# EasyEDA Pro project the ties .epro, board PCB1
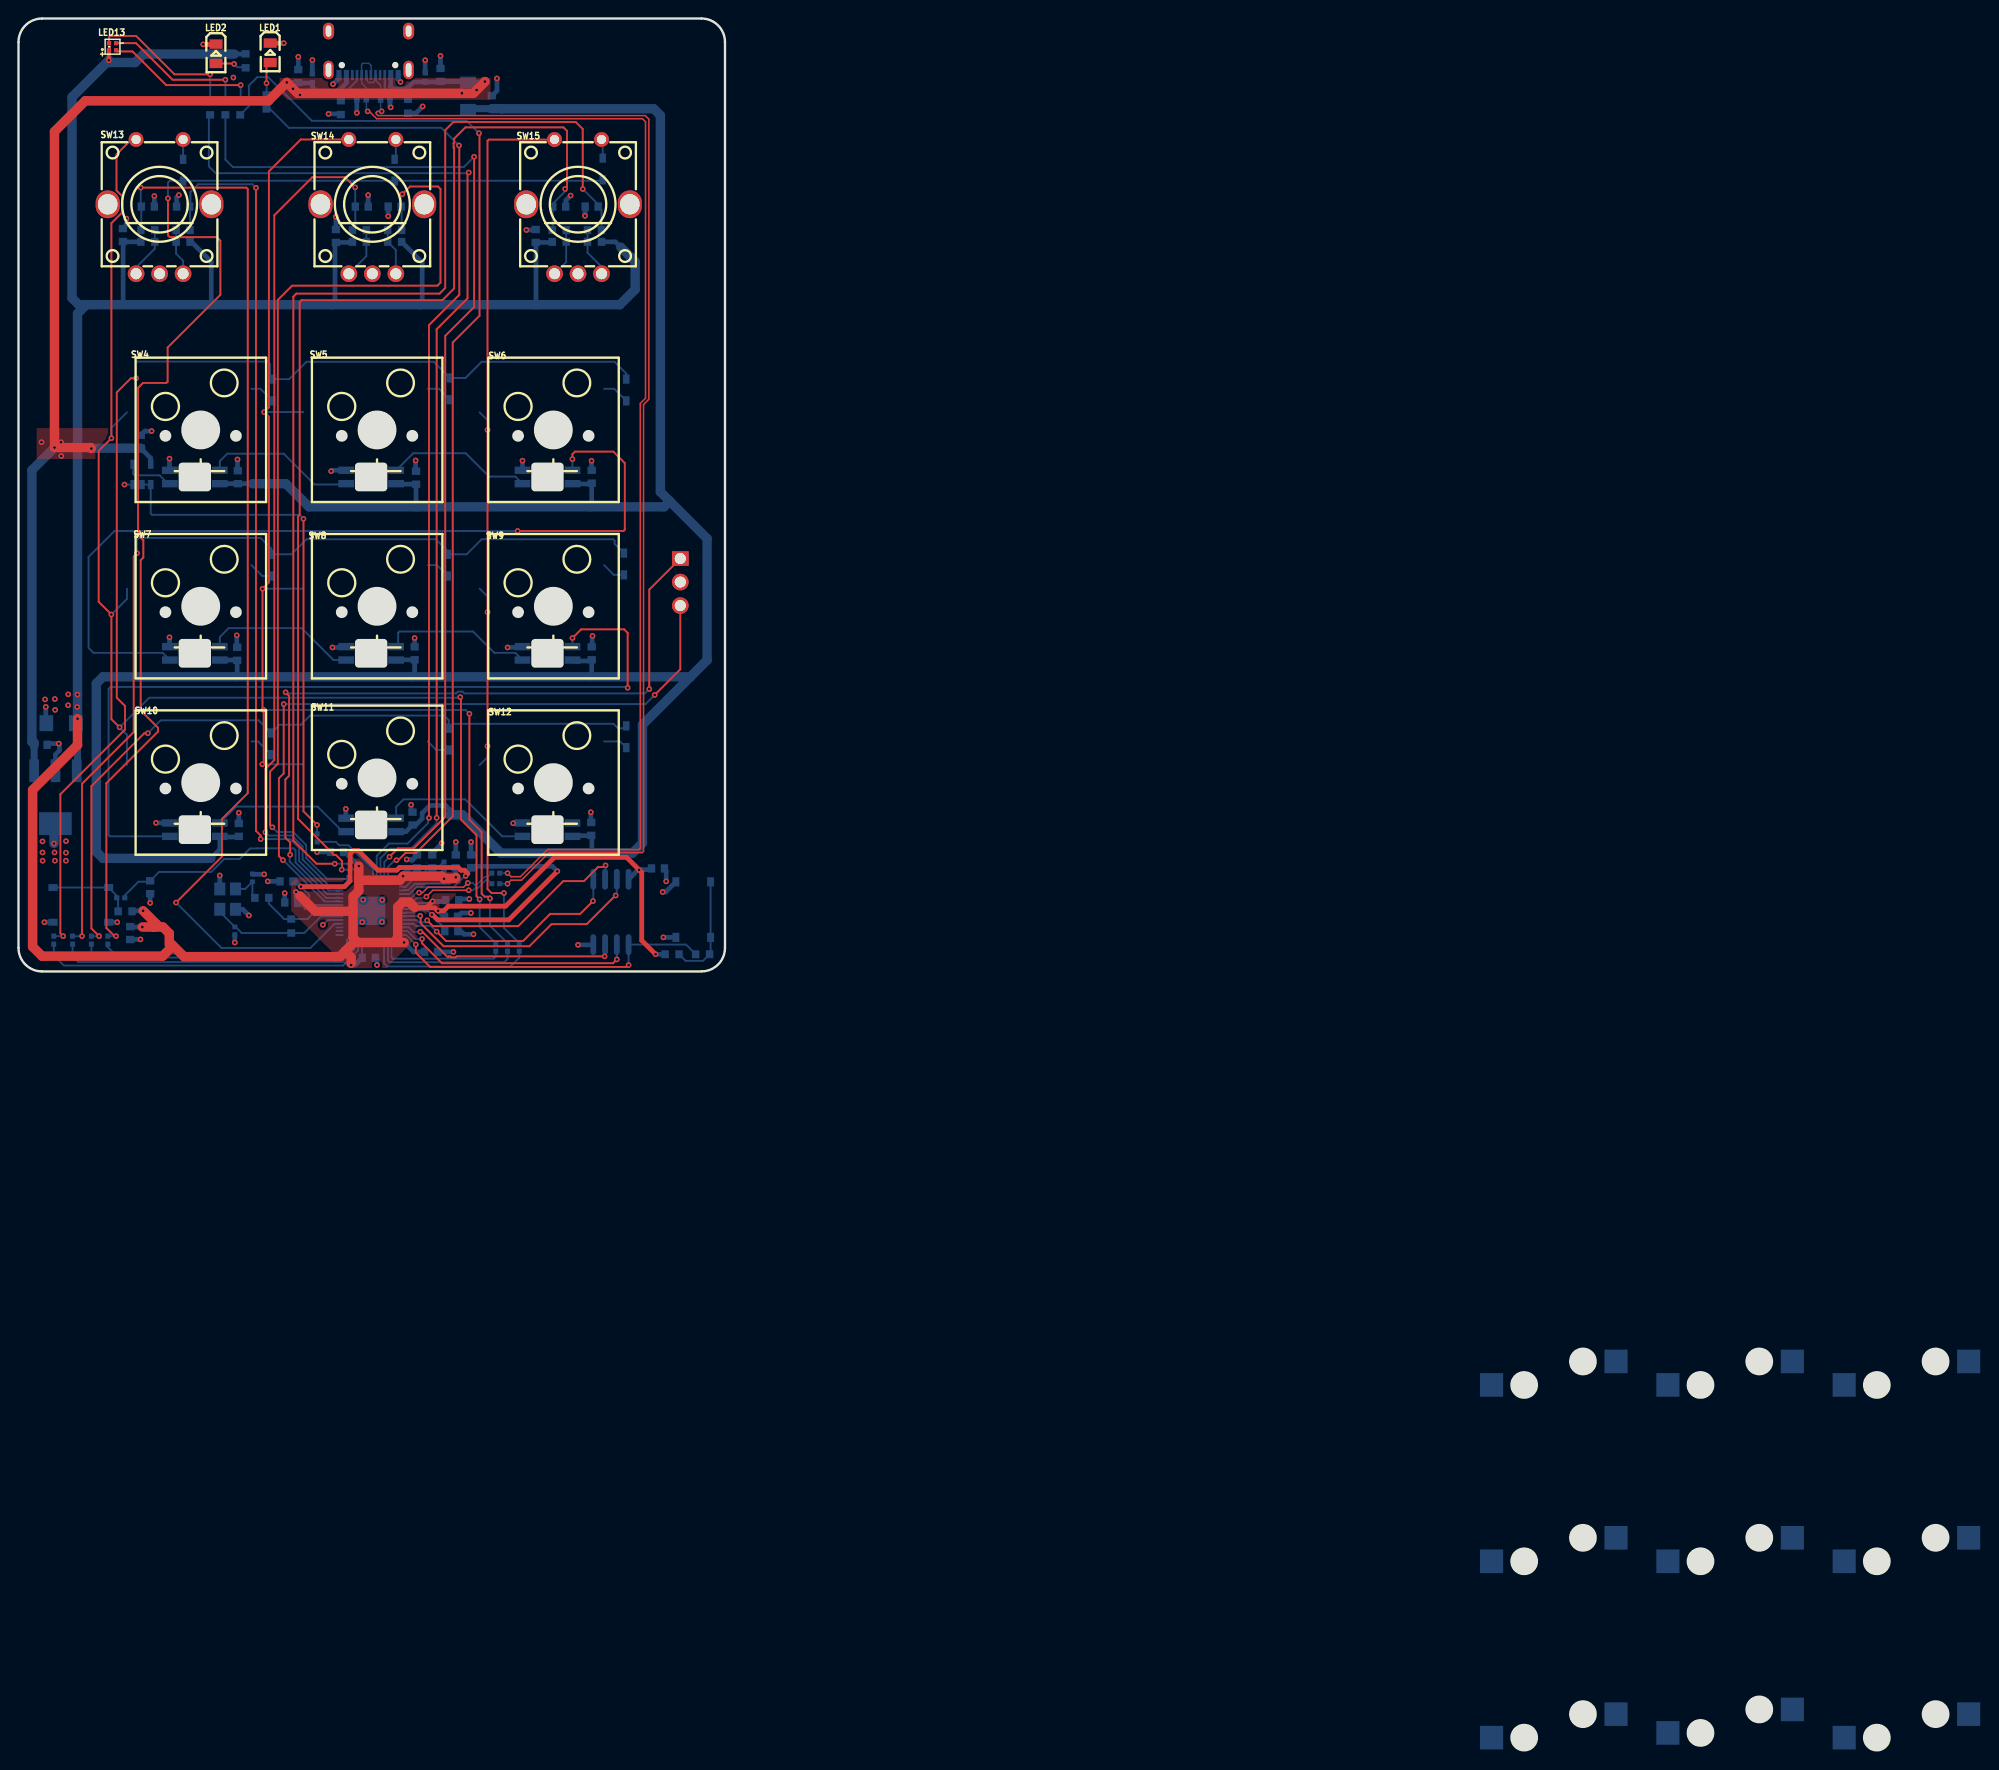
[diagram p2: board, top side]
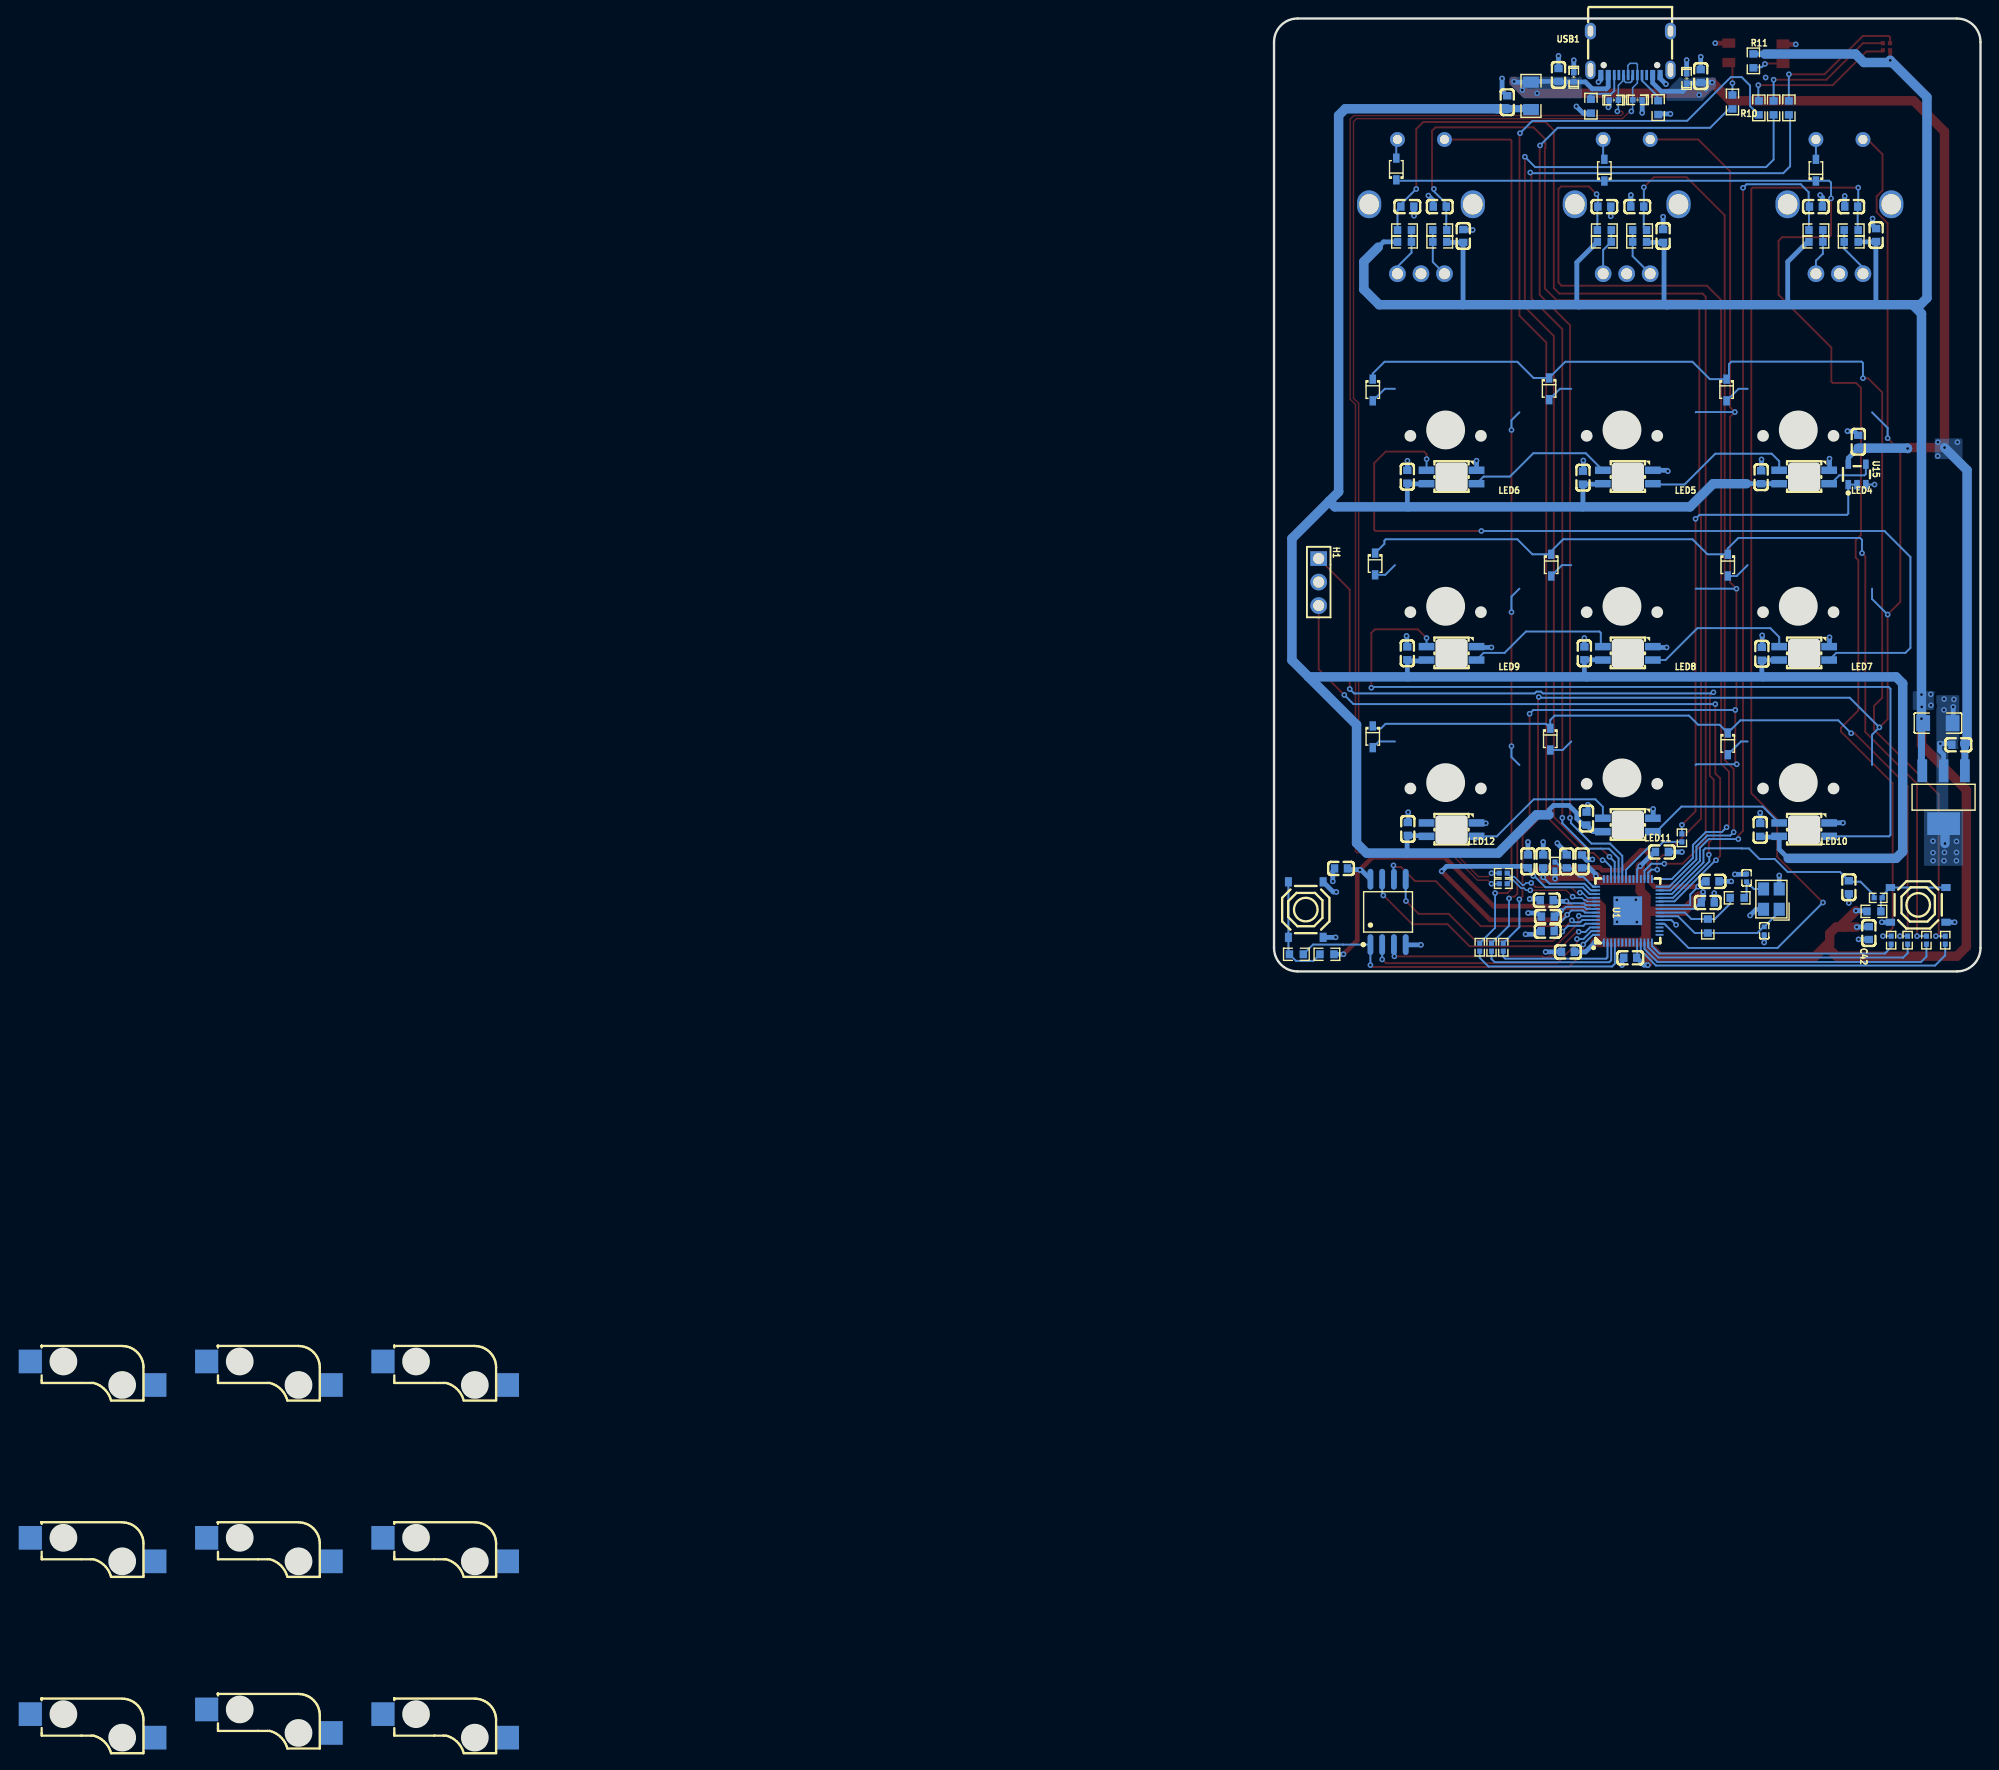
[diagram p3: board, bottom side, seen from below]

Outline 208.62 x 187.22 mm; copper layers: Top Layer, Inner1, Inner2, Bottom Layer. Coordinates in mm from the lower left corner of the outline.
Outline path: 0,184.68 0,86.81 arc(0.74,85.02) 2.54,84.27 73.79,84.27 arc(75.58,85.02) 76.33,86.81 76.33,184.68 arc(75.58,186.48) 73.79,187.22 2.54,187.22 arc(0.74,186.48) 0,184.68
Stack: Top Layer 0.035mm Outer layer thickness 1oz / Dielectric1 0.2104mm 7628 RC49% 8.6mil / Inner1 0.0152mm Inner layer thickness / Dielectric2 1.065mm 1.1mm H/HOZ Copper / Inner2 0.0152mm Inner layer thickness / Dielectric3 0.2104mm 7628 RC49% 8.6mil / Bottom Layer 0.035mm Outer layer thickness 1oz

## Design rules (mm)
net USBN: USB
net USBP: USB
net CON_USB_P: USB_CON
net CON_USB_N: USB_CON
spacing copperThickness1oz (default): track to track 0.178, other pairs 0.076 to 0.305
spacing copperThickness2oz: track to track 0.203, other pairs 0.152 to 0.3
spacing copperThicknessInner0.5oz: track to track 0.089, other pairs 0.152 to 0.3
spacing Plane_innerPlane: track to track 0.178, other pairs 0.076 to 0.305
spacing Copper_copperRegion: track to track 0.178, other pairs 0.076 to 0.305
track width copperThickness1oz (default): min 0.102, default 0.203, max 2.54
track width copperThickness2oz: min 0.203, default 0.254, max 2.54
track width copperThickness0.5oz: min 0.089, default 0.254, max 2.54
differential pair differentialPair (default): width min 0.155, default 0.155, max 0.203; gap min 0.178, default 0.191
region e1 uses Copper_copperRegion
region e2 uses Copper_copperRegion
region e3 uses Copper_copperRegion
region e4 uses Copper_copperRegion
region e5 uses Copper_copperRegion
region e6 uses Copper_copperRegion
region e7 uses Copper_copperRegion
region e8 uses Copper_copperRegion
region e9 uses Copper_copperRegion
region e10 uses Copper_copperRegion
region e11 uses Copper_copperRegion
region e12 uses Copper_copperRegion
region e13 uses Copper_copperRegion
region e14 uses Copper_copperRegion
region e15 uses Copper_copperRegion
region e16 uses Copper_copperRegion
region e17 uses Copper_copperRegion
region e18 uses Copper_copperRegion
region e19 uses Copper_copperRegion
region e20 uses Copper_copperRegion
region e21 uses Copper_copperRegion
region e22 uses Copper_copperRegion
region e23 uses Copper_copperRegion
region e24 uses Copper_copperRegion
region e25 uses Copper_copperRegion
region e26 uses Copper_copperRegion
region e27 uses Copper_copperRegion
region e28 uses Copper_copperRegion
region e29 uses Copper_copperRegion
region e30 uses Copper_copperRegion
region e31 uses Copper_copperRegion
region e32 uses Copper_copperRegion
region e33 uses Copper_copperRegion
region e34 uses Copper_copperRegion
region e35 uses Copper_copperRegion
region e36 uses Copper_copperRegion
region e37 uses Copper_copperRegion
region e38 uses Copper_copperRegion
region e39 uses Copper_copperRegion
region e40 uses Copper_copperRegion
region e41 uses Copper_copperRegion
region e42 uses Copper_copperRegion
region e43 uses Copper_copperRegion
region e44 uses Copper_copperRegion
region e45 uses Copper_copperRegion
region e46 uses Copper_copperRegion
region e47 uses Copper_copperRegion
region e48 uses Copper_copperRegion
region e49 uses Copper_copperRegion
region e50 uses Copper_copperRegion
region e51 uses Copper_copperRegion
region e52 uses Copper_copperRegion
region e53 uses Copper_copperRegion
region e54 uses Copper_copperRegion
region e55 uses Copper_copperRegion
region e56 uses Copper_copperRegion
region e57 uses Copper_copperRegion
region e58 uses Copper_copperRegion
region e59 uses Copper_copperRegion
region e60 uses Copper_copperRegion
region e61 uses Copper_copperRegion
region e62 uses Copper_copperRegion
region e63 uses Copper_copperRegion
region e64 uses Copper_copperRegion
region e65 uses Copper_copperRegion
region e66 uses Copper_copperRegion
region e67 uses Copper_copperRegion
region e68 uses Copper_copperRegion
region e69 uses Copper_copperRegion
region e70 uses Copper_copperRegion
region e71 uses Copper_copperRegion
region e72 uses Copper_copperRegion
region e73 uses Copper_copperRegion
region e74 uses Copper_copperRegion
region e75 uses Copper_copperRegion
region e76 uses Copper_copperRegion
region e77 uses Copper_copperRegion
region e78 uses Copper_copperRegion
region e79 uses Copper_copperRegion
region e80 uses Copper_copperRegion
region e81 uses Copper_copperRegion
region e82 uses Copper_copperRegion
region e83 uses Copper_copperRegion
region e84 uses Copper_copperRegion
region e85 uses Copper_copperRegion
region e86 uses Copper_copperRegion
region e87 uses Copper_copperRegion
region e88 uses Copper_copperRegion
region e89 uses Copper_copperRegion
region e90 uses Copper_copperRegion
region e91 uses Copper_copperRegion
region e92 uses Copper_copperRegion
region e93 uses Copper_copperRegion
region e94 uses Copper_copperRegion
region e95 uses Copper_copperRegion
region e96 uses Copper_copperRegion
region e97 uses Copper_copperRegion
region e98 uses Copper_copperRegion
region e99 uses Copper_copperRegion
region e100 uses Copper_copperRegion
region e101 uses Copper_copperRegion
region e102 uses Copper_copperRegion
region e103 uses Copper_copperRegion
region e104 uses Copper_copperRegion
region e105 uses Copper_copperRegion
region e106 uses Copper_copperRegion
region e107 uses Copper_copperRegion
region e108 uses Copper_copperRegion
region e109 uses Copper_copperRegion
region e110 uses Copper_copperRegion
pour e1516 uses Copper_copperRegion
pour e1518 uses Copper_copperRegion
pour e1520 uses Copper_copperRegion
pour e1522 uses Copper_copperRegion
pour e1524 uses Copper_copperRegion
pour e1526 uses Copper_copperRegion
pour e1528 uses Copper_copperRegion
pour e1530 uses Copper_copperRegion

## Placement (name value [footprint] x y rotation side)
C1  100nF  [C0603]  44.58 86.38 0 bottom
C2  100nF  [C0603]  37.85 85.75 0 bottom
C3  100nF  [C0603]  29.46 91.72 180 bottom
C4  100nF  [C0603]  34.42 97.18 180 bottom
C5  100nF  [C0603]  43.05 96.16 270 bottom
C6  100nF  [C0603]  46.74 90.19 180 bottom
C7  100nF  [C0603]  46.86 91.97 180 bottom
C8  100nF  [C0603]  46.76 88.63 0 bottom
C9  100nF  [C0603]  28.96 94 180 bottom
C10  2.2uf  [C0603]  48.9 96.16 90 bottom
C11  2.2uf  [C0603]  47.24 96.16 90 bottom
C12  2.2uf  [C0603]  44.7 96.16 90 bottom
C13  1uF  [C0603]  45.59 181.12 90 bottom
C14  1uF  [C0603]  30.23 181 90 bottom
C15  1uF  [C0603]  2.39 108.76 0 bottom
C16  47uF  [C1206]  4.6 111.1 0 bottom
C17  15pF  [C0402]  23.37 88.67 270 bottom
C18  15pF  [C0402]  25.27 94.38 90 bottom
C19  100nF  [C0603]  69.09 95.4 0 bottom
C20  100nF  [C0603]  14.22 93.37 90 bottom
C21  10nF  [C0603]  13.97 166.9 180 bottom
C22  10nF  [C0603]  17.78 166.9 0 bottom
C23  2.2uf  [C0603]  11.28 163.83 90 bottom
C24  10nF  [C0603]  37.08 166.9 180 bottom
C25  10nF  [C0603]  40.64 166.9 0 bottom
C26  2.2uf  [C0603]  34.29 163.73 90 bottom
C27  10nF  [C0603]  58.42 166.9 180 bottom
C28  10nF  [C0603]  61.92 166.9 0 bottom
C29  2.2uf  [C0603]  55.88 163.73 90 bottom
C31  100nF  [C0603]  23.7 137.66 90 bottom
C32  100nF  [C0603]  42.95 137.61 90 bottom
C33  100nF  [C0603]  61.93 137.72 90 bottom
C34  100nF  [C0603]  23.62 118.59 90 bottom
C35  100nF  [C0603]  42.8 118.64 90 bottom
C36  100nF  [C0603]  61.93 118.64 90 bottom
C37  100nF  [C0603]  23.8 99.56 90 bottom
C38  100nF  [C0603]  42.57 100.78 90 bottom
C39  100nF  [C0603]  61.87 99.67 90 bottom
C40  100nF  [C0603]  13.21 141.5 270 bottom
C41  1uF  [C0603]  51.13 178.18 90 bottom
C42  100nF  [C0603]  12.07 88.41 90 bottom
D2  GG0402052R542P  [D0402-BI]  39.62 178.41 0 bottom
D3  GG0402052R542P  [D0402-BI]  37.06 178.43 0 bottom
D4  GG0402052R542P  [D0402-BI]  43.94 180.87 270 bottom
D5  GG0402052R542P  [D0402-BI]  31.75 180.74 270 bottom
D6  1N5819WS  [SOD-323_L1.8-W1.3-LS2.5-RD]  27.43 147.09 270 bottom
D7  1N5819WS  [SOD-323_L1.8-W1.3-LS2.5-RD]  46.61 147.22 270 bottom
D8  1N5819WS  [SOD-323_L1.8-W1.3-LS2.5-RD]  65.66 147.09 270 bottom
D9  1N5819WS  [SOD-323_L1.8-W1.3-LS2.5-RD]  27.3 128.17 270 bottom
D10  1N5819WS  [SOD-323_L1.8-W1.3-LS2.5-RD]  46.38 128.17 270 bottom
D11  1N5819WS  [SOD-323_L1.8-W1.3-LS2.5-RD]  65.41 128.29 270 bottom
D12  1N5819WS  [SOD-323_L1.8-W1.3-LS2.5-RD]  27.3 108.86 270 bottom
D13  1N5819WS  [SOD-323_L1.8-W1.3-LS2.5-RD]  46.48 109.37 270 bottom
D14  1N5819WS  [SOD-323_L1.8-W1.3-LS2.5-RD]  65.66 109.62 270 bottom
D15  1N5819WS  [SOD-323_L1.8-W1.3-LS2.5-RD]  17.78 170.84 90 bottom
D16  1N5819WS  [SOD-323_L1.8-W1.3-LS2.5-RD]  40.64 170.84 90 bottom
D17  1N5819WS  [SOD-323_L1.8-W1.3-LS2.5-RD]  63.12 170.96 90 bottom
H1  2.54-1*3P针  [HDR-TH_3P-P2.54-V-M-1]  71.5 126.34 270 bottom
LED1  KT-0805Y  [LED0805-R-RD]  27.19 183.51 270 top
LED2  KT-0805G  [LED0805-R-RD]  21.34 183.41 270 top
LED4  SK6812MINI-E  [LED-SMD_4P-L3.2-W2.8-LS5.9_SK6812MINI-E]  19.05 137.69 0 bottom
LED5  SK6812MINI-E  [LED-SMD_4P-L3.2-W2.8-LS5.9_SK6812MINI-E]  38.1 137.69 0 bottom
LED6  SK6812MINI-E  [LED-SMD_4P-L3.2-W2.8-LS5.9_SK6812MINI-E]  57.15 137.69 0 bottom
LED7  SK6812MINI-E  [LED-SMD_4P-L3.2-W2.8-LS5.9_SK6812MINI-E]  19.05 118.64 0 bottom
LED8  SK6812MINI-E  [LED-SMD_4P-L3.2-W2.8-LS5.9_SK6812MINI-E]  38.1 118.64 0 bottom
LED9  SK6812MINI-E  [LED-SMD_4P-L3.2-W2.8-LS5.9_SK6812MINI-E]  57.15 118.64 0 bottom
LED10  SK6812MINI-E  [LED-SMD_4P-L3.2-W2.8-LS5.9_SK6812MINI-E]  19.05 99.59 0 bottom
LED11  SK6812MINI-E  [LED-SMD_4P-L3.2-W2.8-LS5.9_SK6812MINI-E]  38.1 100.1 0 bottom
LED12  SK6812MINI-E  [LED-SMD_4P-L3.2-W2.8-LS5.9_SK6812MINI-E]  57.15 99.59 0 bottom
LED13  NH-B1010RGBT-HF  [LED-ARRAY-SMD_4P-L1.0-W1.0-TR_NH-B1010RGBT]  10.16 184.17 180 top
NFR8  100kΩ  [R0603]  70.61 86.13 180 bottom
R1  200Ω  [R0402]  45.97 95.65 90 bottom
R2  27Ω  [R0402]  51.56 94.89 0 bottom
R3  27Ω  [R0402]  51.56 93.75 0 bottom
R4  5.1kΩ  [R0603]  42.09 177.75 90 bottom
R5  5.1kΩ  [R0603]  34.82 177.59 90 bottom
R6  1k  [R0603]  26.29 92.22 180 bottom
R7  1k  [R0603]  73.91 86.13 180 bottom
R7NF  1MΩ  [R0603]  29.46 89.18 270 bottom
R8  10kΩ  [R0603]  11.51 90.76 0 bottom
R9  27Ω  [R0402]  11.05 92.22 0 bottom
R10  1k  [R0603]  26.8 178.2 90 bottom
R11  1k  [R0603]  24.54 182.65 270 bottom
R12  27Ω  [R0402]  51.56 86.89 270 bottom
R13  27Ω  [R0402]  52.83 86.89 270 bottom
R14  27Ω  [R0402]  54.1 86.89 270 bottom
R18  0Ω  [R0402]  3.81 87.65 90 bottom
R19  0Ω  [R0402]  5.84 87.65 90 bottom
R20  0Ω  [R0402]  7.87 87.65 90 bottom
R21  1k  [R0603]  13.97 163.09 0 bottom
R22  1k  [R0603]  17.78 163.09 180 bottom
R23  1k  [R0603]  13.97 164.36 180 bottom
R24  1k  [R0603]  17.78 164.36 0 bottom
R25  0Ω  [R0402]  9.65 87.65 90 bottom
R26  1k  [R0603]  36.83 163.09 0 bottom
R27  1k  [R0603]  40.64 163.09 180 bottom
R28  1k  [R0603]  36.83 164.36 180 bottom
R29  1k  [R0603]  40.64 164.36 0 bottom
R30  1k  [R0603]  58.42 163.09 0 bottom
R31  1k  [R0603]  62.23 163.09 180 bottom
R32  1k  [R0603]  58.42 164.36 180 bottom
R33  1k  [R0603]  62.23 164.36 0 bottom
R34  27Ω  [R0402]  32.26 98.7 270 bottom
R35  100mΩ  [R1206]  48.57 178.86 270 bottom
R36  1k  [R0603]  20.7 177.57 90 bottom
R37  1k  [R0603]  22.35 177.57 90 bottom
R38  1k  [R0603]  23.95 177.57 90 bottom
SW1  TS-1187A-B-A-B  [SW-SMD_4P-L5.1-W5.1-P3.70-LS6.5-TL_H1.5]  72.9 90.95 270 bottom
SW2  TS-1187A-B-A-B  [SW-SMD_4P-L5.1-W5.1-P3.70-LS6.5-TL_H1.5]  6.73 91.46 0 bottom
SW4  CPG151101S03  [KEY-TH_CPG1511F01S0X]  19.05 141.5 0 top
SW5  CPG151101S03  [KEY-TH_CPG1511F01S0X]  38.1 141.5 0 top
SW6  CPG151101S03  [KEY-TH_CPG1511F01S0X]  57.15 141.5 0 top
SW7  CPG151101S03  [KEY-TH_CPG1511F01S0X]  19.05 122.45 0 top
SW8  CPG151101S03  [KEY-TH_CPG1511F01S0X]  38.1 122.45 0 top
SW9  CPG151101S03  [KEY-TH_CPG1511F01S0X]  57.15 122.45 0 top
SW10  CPG151101S03  [KEY-TH_CPG1511F01S0X]  19.05 103.4 0 top
SW11  CPG151101S03  [KEY-TH_CPG1511F01S0X]  38.1 103.91 0 top
SW12  CPG151101S03  [KEY-TH_CPG1511F01S0X]  57.15 103.4 0 top
SW13  PEC12R-4120F-S0012  [SW-TH_PEC12R-4120F-S0012]  15.24 166.9 0 top
SW14  PEC12R-4120F-S0012  [SW-TH_PEC12R-4120F-S0012]  38.23 166.9 0 top
SW15  PEC12R-4120F-S0012  [SW-TH_PEC12R-4120F-S0012]  60.45 166.9 0 top
U1  RP2040  [LQFN-56_L7.0-W7.0-P0.4-EP]  38.1 90.83 90 bottom
U2  LM3940IMP-3.3/NOPB  [SOT-223_L6.5-W3.5-P2.30-LS7.0-BR]  3.99 103.1 90 bottom
U3  12MHz  [CRYSTAL-SMD_4P-L3.2-W2.5-BL]  22.59 92.08 90 bottom
U4  W25Q128JVSIQ  [SOIC-8_L5.3-W5.3-P1.27-LS8.0-BL]  64.01 90.7 180 bottom
U5  CPG151101S11-16  [SMD_KEYBOARD-SW]  38.1 123.09 0 bottom
U6  CPG151101S11-16  [SMD_KEYBOARD-SW]  57.15 123.09 0 bottom
U7  CPG151101S11-16  [SMD_KEYBOARD-SW]  19.05 104.04 0 bottom
U8  CPG151101S11-16  [SMD_KEYBOARD-SW]  38.1 104.54 0 bottom
U9  CPG151101S11-16  [SMD_KEYBOARD-SW]  57.15 104.04 0 bottom
U10  CPG151101S11-16  [SMD_KEYBOARD-SW]  38.1 142.14 0 bottom
U11  CPG151101S11-16  [SMD_KEYBOARD-SW]  19.05 142.14 0 bottom
U12  CPG151101S11-16  [SMD_KEYBOARD-SW]  57.15 142.14 0 bottom
U13  CPG151101S11-16  [SMD_KEYBOARD-SW]  19.05 123.09 0 bottom
U15  SN74LV1T34DBVR  [SOT-23-5_L2.9-W1.6-P0.95-LS2.8-BR]  13.34 137.97 270 bottom
USB1  TYPE-C 16PIN 2MD(073)  [USB-C-SMD_TYPE-C-16PIN-2MD-073]  37.82 183.49 0 bottom

## Footprints (pads in the part's own frame, mm; a bottom-side part is the same pattern mirrored in y, then rotated)
C0402
  rect 0.5x0.54 smd: 1(-0.42,0) 2(0.42,0)
C0603
  rect 0.8x0.9 smd: 1(-0.7,0) 2(0.7,0)
C1206
  rect 1.485x1.728 smd: 1(-1.593,0) 2(1.593,0)
CRYSTAL-SMD_4P-L3.2-W2.5-BL
  rect 1.4x1.2 smd: 1(-1.1,-0.85) 2(1.1,-0.85) 3(1.1,0.85) 4(-1.1,0.85)
D0402-BI
  rect 0.6x0.6 smd: 1(-0.5,0) 2(0.5,0)
HDR-TH_3P-P2.54-V-M-1
  rect 1.575x1.8 hole 1.2: 1(-2.54,0)
  round 1.8 hole 1.2: 2(0,0) 3(2.54,0)
LED0805-R-RD
  rect 1x1.399 smd: 1(1.05,0) 2(-1.05,0)
LED-ARRAY-SMD_4P-L1.0-W1.0-TR_NH-B1010RGBT
  rect 0.45x0.45 smd: 1(0.385,0.385) 2(0.385,-0.385) 3(-0.385,-0.385) 4(-0.385,0.385)
LED-SMD_4P-L3.2-W2.8-LS5.9_SK6812MINI-E
  rect 1.7x0.8 smd: 1(-2.7,-0.725) 2(-2.7,0.725) 3(2.7,0.725) 4(2.7,-0.725)
LQFN-56_L7.0-W7.0-P0.4-EP
  rect 0.85x0.2 smd: 1(-3.425,2.6) 2(-3.425,2.2) 3(-3.425,1.8) 4(-3.425,1.4) 5(-3.425,1) 6(-3.425,0.6) 7(-3.425,0.2) 8(-3.425,-0.2) 9(-3.425,-0.6) 10(-3.425,-1) 11(-3.425,-1.4) 12(-3.425,-1.8) 13(-3.425,-2.2) 14(-3.425,-2.6) 29(3.425,-2.6) 30(3.425,-2.2) 31(3.425,-1.8) 32(3.425,-1.4) 33(3.425,-1) 34(3.425,-0.6) 35(3.425,-0.2) 36(3.425,0.2) 37(3.425,0.6) 38(3.425,1) 39(3.425,1.4) 40(3.425,1.8) 41(3.425,2.2) 42(3.425,2.6)
  rect 0.2x0.85 smd: 15(-2.6,-3.425) 16(-2.2,-3.425) 17(-1.8,-3.425) 18(-1.4,-3.425) 19(-1,-3.425) 20(-0.6,-3.425) 21(-0.2,-3.425) 22(0.2,-3.425) 23(0.6,-3.425) 24(1,-3.425) 25(1.4,-3.425) 26(1.8,-3.425) 27(2.2,-3.425) 28(2.6,-3.425) 43(2.6,3.425) 44(2.2,3.425) 45(1.8,3.425) 46(1.4,3.425) 47(1,3.425) 48(0.6,3.425) 49(0.2,3.425) 50(-0.2,3.425) 51(-0.6,3.425) 52(-1,3.425) 53(-1.4,3.425) 54(-1.8,3.425) 55(-2.2,3.425) 56(-2.6,3.425)
  rect 3.1x3.1 smd: 57(0,0)
R0402
  rect 0.566x0.54 smd: 1(-0.433,0) 2(0.433,0)
R0603
  rect 0.806x0.864 smd: 1(-0.753,0) 2(0.753,0)
R1206
  rect 1.208x1.701 smd: 1(-1.479,0) 2(1.479,0)
SMD_KEYBOARD-SW
  rect 2.5x2.55 smd: 1(140.1,102.54) 2(153.55,100)
SOD-323_L1.8-W1.3-LS2.5-RD
  rect 1x0.7 smd: 1(-1.173,0) 2(1.173,0)
SOIC-8_L5.3-W5.3-P1.27-LS8.0-BL
  oval 0.63x2.25 smd: 1(-1.905,-3.53) 2(-0.635,-3.53) 3(0.635,-3.53) 4(1.905,-3.53) 5(1.905,3.53) 6(0.635,3.53) 7(-0.635,3.53) 8(-1.905,3.53)
SOT-23-5_L2.9-W1.6-P0.95-LS2.8-BR
  rect 1x0.6 smd: 1(1.1,-0.95) 2(1.1,0) 3(1.1,0.95) 4(-1.1,0.95) 5(-1.1,-0.95)
SOT-223_L6.5-W3.5-P2.30-LS7.0-BR
  rect 2.465x1.05 smd: 1(2.857,-2.3) 2(2.857,0) 3(2.857,2.3)
  rect 2.465x3.54 smd: 4(-2.857,0)
SW-SMD_4P-L5.1-W5.1-P3.70-LS6.5-TL_H1.5
  rect 1x0.75 smd: 1(-3,1.875) 2(3,1.875) 3(-3,-1.875) 4(3,-1.875)
SW-TH_PEC12R-4120F-S0012
  round 1.6 hole 1: 1(-2.54,7.25) 2(2.54,7.25)
  oval 2.6x3 hole 2.1x2.2: 3(5.6,0.25)
  oval 2.6x3 hole 2.1x2.205: 4(-5.6,0.25)
  round 1.8 hole 1.2: A(-2.54,-7.25) B(2.54,-7.25) C(0,-7.25)
USB-C-SMD_TYPE-C-16PIN-2MD-073
  oval 1.2x1.8 hole 0.6x1.2: 13(-4.325,-2.375) 14(4.325,-2.375)
  oval 1.1x2 hole 0.6x1.5: 13(-4.325,1.825) 14(4.325,1.825)
  rect 0.55x1.1 smd: A1B12(-3.2,2.375) A4B9(-2.4,2.375) B1A12(3.2,2.375) B4A9(2.4,2.375)
  rect 0.3x1.1 smd: A5(-1.25,2.375) A6(-0.25,2.375) A7(0.25,2.375) A8(1.25,2.375) B5(1.75,2.375) B6(0.75,2.375) B7(-0.75,2.375) B8(-1.75,2.375)

## Nets
As in the schematic.

Pads without a net: LED12 4; U1 5 6 7 8 9 15 16 17 32 34 35 41; USB1 A8 B8

## Via types
v1: diameter 0.61, hole 0.305, Top Layer to Bottom Layer, 200 vias

## Routing (per net, layer and track width the routed paths; a pad name or vN(x,y) marks a point on that pad's centre or on a via; arc(x,y) is an arc through that point)
3V3A: length 5.6
  Bottom Layer w0.203: R1.2 45.93,96.13 45.35,95.54 45.35,95.54 45.27,95.46 C12.1
  Bottom Layer w0.205: U1.43 41.84,93.43 42.93,94.51 43.35,94.51 44.3,95.46 C12.1
+1V1: length 69.3
  Top Layer w0.508: 48.56,94.84 48.18,95.21 47.8,95.21 47.51,95.5 41.16,95.5 40.87,95.21 38.83,95.21 36.71,97.33 36.2,97.33 35.84,96.97 35.84,96.06 35.82,96.04 35.82,94.04 35.22,93.43 v1(30.51,93.43) ; v1(58.22,95.09) 52.97,89.85 45.28,89.85 44.72,90.4 v1(44.65,90.4)
  Bottom Layer w0.205: U1.23 31.36,91.43 31.36,92.58 v1(30.51,93.43) ; U1.50 42.73,90.63 42.96,90.86 44.19,90.86 v1(44.65,90.4) 44.69,90.36 44.69,90.29 46.06,88.92 46.06,88.75 ; C10.1 48.9,95.26 47,93.37 42.96,93.37 42.22,92.63 U1.45
  Bottom Layer w0.508: v1(30.51,93.43) 29.94,94 C9.1 ; C10.1 49.06,95.63 57.68,95.63 v1(58.22,95.09)
  vias: v1(48.31,94.59)
+3V3: length 396.7
  Top Layer w0.406: v1(9.75,182.7) 9.75,183.77 9.77,183.79
  Top Layer w0.508: 42.84,91.14 43.03,91.14 ; 43.03,91.14 44.95,91.14 45.27,90.83 v1(45.34,90.83) 45.95,90.83 46.44,91.32 52.62,91.32 57.89,96.6 65.7,96.6 v1(67.06,95.25) 67.34,94.97 67.34,87.62 v1(68.83,86.13) ; 43.03,91.14 44.07,91.18 v1(44.73,91.84)
  Top Layer w1.016: 36.14,90.78 36.14,92.35 36.77,92.97 36.77,94.12 ; 36.14,90.78 32.05,90.78 30.39,92.44 ; 36.14,90.78 36.14,87.91 36.65,87.4 ; 14.62,89.07 15.6,89.07 16.29,88.38 16.29,87.2 ; 14.62,89.07 14.92,89.37 v1(13.46,90.83) ; 14.62,89.07 v1(13.38,89.07) ; 36.65,87.4 v1(41.66,87.4) ; 36.65,87.4 36.22,87.4 35.27,86.46 ; 35.27,86.46 34.7,85.88 34.24,85.88 34.24,85.87 17.88,85.87 16.56,87.2 ; 35.27,86.46 35.94,85.79 35.94,85.16 ; 36.77,94.12 41.19,94.12 41.59,94.52 v1(41.55,94.56) 45.7,94.56 v1(45.97,94.29) 46.02,94.33 47.13,94.33 v1(47.24,94.44) ; 36.77,94.12 v1(36.77,95.65) ; v1(6.38,111.58) 6.38,108.73 1.52,103.88 1.52,86.94 2.54,85.93 15.57,85.93 16.29,86.64 ; 42.8,91.18 42.23,91.75 41.49,91.75 40.97,91.23 40.97,87.88 40.79,87.7
  Bottom Layer w0.205: v1(45.34,90.83) 45.21,90.83 44.8,91.24 42.8,91.24 42.58,91.03 U1.49 ; U1.42 41.25,94.25 v1(41.55,94.56) ; U1.33 37.1,95.32 v1(36.77,95.65) ; U1.10 37.1,85.79 C2.1 ; U1.1 v1(41.66,87.4) ; U1.44 42.08,93.03 42.8,93.75 46.55,93.75 v1(47.24,94.44) ; U1.48 42.64,91.43 42.84,91.63 44.52,91.63 v1(44.73,91.84) ; 30.23,91.78 30.98,91.03 U1.22
  Bottom Layer w0.508: v1(36.77,95.65) 35.24,97.18 35.05,97.18 ; 23.32,183.38 24.52,183.38 R11.1 ; 43.41,156.3 43.61,156.5 43.61,160.87 R27.1 ; 65.06,162.52 64.49,163.09 R31.1 ; v1(29.97,92.86) 29.97,92.03 30.23,91.78 30.23,91.72 C3.1 ; v1(13.38,89.07) 12.35,89.07 12.32,89.09 ; 43.88,86.64 43.62,86.38 42.68,86.38 v1(41.66,87.4) ; 33.85,156.3 34.19,156.64 34.19,162.92 C26.1 36.01,163.03 R26.1 ; C29.1 57.6,163.03 R30.1 ; 43.05,95.53 43,95.47 42.28,95.47 41.55,94.75 v1(41.55,94.56) ; U4.8 66.93,95.25 v1(67.06,95.25) 67.08,95.27 68.33,95.27 ; 45.97,95.11 v1(45.97,94.29) ; 55.91,156.3 55.91,162.95 55.81,163.05 ; C6.2 45.97,90.19 v1(45.34,90.83) ; C2.1 36.36,84.96 v1(35.94,84.96) ; 18.61,163.17 20.83,160.95 20.83,156.57 20.63,156.38 ; 69.68,86.13 v1(68.83,86.13) ; 11.3,156.38 11.3,163.02 11.43,163.15 11.56,163.15 11.62,163.09 R21.1 ; 12.61,90.83 v1(13.46,90.83) ; v1(44.73,91.84) 46.04,91.84 C7.2 ; 47.24,95.27 v1(47.24,94.44)
  Bottom Layer w0.762: U2.3 6.38,106.04 6.38,111.38
  Bottom Layer w1.016: 7.33,156.3 6.5,156.3 5.78,157.02 5.78,178.73 v1(9.75,182.7) 9.75,182.47 12.6,182.47 13.51,183.38 23.32,183.38 ; 7.33,156.3 6.38,155.35 v1(6.38,111.58) 6.38,111.38 ; 7.33,156.3 64.97,156.3 66.62,157.95 66.62,160.96 65.06,162.52
  vias: v1(5.37,114.21) v1(5.36,113.03) v1(6.37,114.18) v1(6.35,112.85)
+5V_LEDS: length 310
  Bottom Layer w0.508: 40.95,117.82 41.08,117.94 C35.1 42.8,116.34 42.56,116.1 ; 23.8,98.79 21.93,98.79 21.9,98.77 ; LED12.3 59.92,98.94 61.87,98.94 ; LED10.3 21.75,97.46 20.78,96.49 ; 61.95,97.06 61.95,98.89 C39.1 ; 42.91,136.94 42.88,136.91 41.08,136.91 41.03,136.87 40.95,136.87 ; 21.75,117.92 23.6,117.92 C34.1 23.62,116.24 23.48,116.1 ; C33.1 61.93,136.94 ; 61.93,136.94 59.88,136.94 LED6.3 ; 61.93,136.94 61.93,134.55 61.84,134.46 ; 25.27,136.96 C31.1 ; 61.93,117.82 60,117.82 ; 61.93,117.82 C36.1 ; 61.93,117.82 61.93,116.15 61.87,116.1 ; 46.61,101.19 46.61,101.72 46.13,102.21 44.45,102.21 43.61,101.37 43.61,100.78 42.91,100.08 C38.1 41.86,99.37 LED11.3 ; C32.1 42.95,134.51 43,134.46 ; LED4.3 23.7,136.97 ; 60.08,98.84 60,98.77
  Bottom Layer w0.762: C41.1 48.66,177.48 R35.2
  Bottom Layer w1.016: 72.59,116.1 67.41,110.92 67.41,98.14 66.33,97.06 52.11,97.06 47.98,101.19 46.61,101.19 ; 72.59,116.1 74.4,117.9 74.4,131.04 70.36,135.07 ; 72.59,116.1 25.81,116.1 ; 70.36,135.07 69.35,136.08 69.35,176.75 68.63,177.47 52.22,177.47 52.21,177.48 C41.1 ; 70.36,135.07 69.75,134.46 31.38,134.46 28.88,136.96 25.27,136.96 ; 25.53,116.1 9.13,116.1 8.41,115.38 8.41,97.21 9.13,96.49 20.78,96.49
GND: length 94.9
  Top Layer w0.508: 21.34,184.43 v1(19.96,184.43) ; 27.27,184.56 v1(28.66,184.56)
  Bottom Layer w0.203: U1.19 33.4,89.83 v1(32.89,89.31) ; U15.3 v1(11.45,136.87) 11.4,136.83
  Bottom Layer w0.508: 4.42,108.89 4.42,108.12 3.99,107.69 U2.2 ; 4.42,108.89 4.42,108.89 3.22,108.89 C15.2 ; 4.42,108.89 v1(4.34,108.89) ; 35.05,119.27 v1(33.92,119.27) ; 36.55,178.41 v1(36.55,177.03) ; v1(69.6,92.86) 69.93,92.86 SW1.1 ; v1(14.38,142.64) 13.65,142.64 C40.1 ; v1(39.95,165.86) 39.94,165.86 C25.1 ; 44.7,97.06 45.72,98.07 v1(45.72,98.14) ; 54.6,119.27 v1(52.84,119.27) ; 16.31,119.24 v1(16.31,120.37) ; 48.9,96.8 v1(48.9,98.26) ; 45.59,181.8 v1(45.59,183.18) ; C9.2 v1(26.92,94) ; v1(41.27,180.36) 41.02,180.62 USB1.B1A12 ; D2.2 40.12,177.7 v1(40.21,177.62) ; v1(59.65,168.09) 59.14,167.59 59.14,166.86 59.12,166.88 C27.1 ; 23.58,119.45 v1(23.58,120.58) ; SW1.2 v1(69.68,87.95) ; v1(43.66,177.72) 42.93,176.99 R4.1 ; 47.24,96.8 v1(47.24,98.26) ; C17.2 v1(23.37,87.4) ; 42.91,138.34 v1(42.91,139.47) ; U3.4 24.23,90.98 v1(24.89,90.32) ; v1(62.02,120.52) 61.98,120.48 61.98,119.34 ; C18.2 25.31,94.76 v1(26.54,94.76) ; v1(38.74,84.96) 38.74,85.56 C2.2 ; v1(11.66,165.6) 11.66,164.91 C23.2 ; v1(61.2,165.91) 61.2,166.31 61.22,166.33 C28.1 ; C35.2 v1(42.8,120.29) ; 33.72,97.18 v1(32.26,97.18) ; C38.2 42.42,101.64 v1(42.42,102.28) ; 16.31,138.29 v1(16.31,139.67) ; U3.2 v1(21.74,94.64) ; 23.66,138.46 v1(23.66,139.59) ; v1(69.98,94) 69.98,95.08 69.91,95.15 ; v1(51.69,180.74) 51.69,179.41 51.13,178.85 ; 12.32,87.73 v1(13.17,87.73) ; C16.1 2.95,111.15 v1(2.95,112.85) ; USB1.A1B12 34.62,180.77 v1(33.99,180.13) ; 61.84,100.34 v1(61.84,101.47) ; 54.43,139.47 v1(54.45,139.45) 54.45,138.42 ; v1(41.93,96.37) 42.35,96.37 42.42,96.29 42.55,96.29 43.1,96.84 ; v1(48.88,90.59) 47.86,90.59 47.47,90.19 ; 31.75,181.35 v1(31.75,182.73) ; 14.22,92.52 v1(14.22,91.67) ; v1(60.45,87.14) 62.08,87.14 U4.4 ; 34.65,176.92 v1(33.5,176.92) ; 55.88,164.38 v1(54.87,164.38) ; 23.8,100.29 v1(23.8,101.42) ; C22.1 17.08,167.9 v1(17.32,168.14) ; C14.2 v1(30.23,183.08) ; C3.2 v1(28.76,92.73) ; 61.91,138.31 v1(61.91,139.44) ; v1(49.15,88.29) 48.14,88.29 47.67,88.75 ; SW2.2 v1(10.67,89.59) ; 47.51,92.1 v1(48.71,92.1) ; 35.55,138.32 35.45,138.42 33.88,138.42 v1(33.78,138.32) ; 37.77,168.17 37.78,168.16 C24.1 ; C1.2 v1(46.99,86.38) ; 43.94,181.33 v1(43.94,182.71) ; 35.36,100.7 v1(35.36,101.83) ; v1(14.85,100.33) 16.24,100.33 16.34,100.23 ; SW2.1 v1(2.79,89.59) ; C21.1 v1(14.67,168.04) ; 54.58,100.28 v1(53.45,100.28) ; 34.29,164.66 v1(34.29,165.81)
  Bottom Layer w1.016: U2.4 3.84,100.09 v1(3.84,98.09)
  vias: v1(2.59,98.32) v1(2.59,97.13) v1(2.6,96.24) v1(2.87,113.66) v1(3.9,97.13) v1(3.93,113.7) v1(3.95,112.53) v1(3.94,96.24) v1(5.13,98.35) v1(5.13,97.1) v1(5.12,96.23) v1(23.22,180.84) v1(37.13,89.61) v1(37.24,92.02) v1(37.77,168.14) v1(39.29,92) v1(39.27,89.63)
COL0: length 144.7
  Top Layer w0.203: v1(49.82,92.06) 49.48,92.4 49.48,99.01 47.8,100.68 47.8,113.84 v1(47.73,113.92) ; v1(10.92,110.64) 10.03,111.53 v1(10.03,122.83) 8.66,124.2 8.66,140.51 v1(10.03,141.88) 10.03,165.11 11.22,166.3 11.22,168 10.58,168.64 10.58,172.54 12.19,174.15 SW13.1
  Bottom Layer w0.203: v1(10.03,141.88) 10.03,142.99 11.72,144.68 ; v1(49.82,92.06) 49.82,89.06 51.56,87.32 ; v1(47.73,113.92) 47.65,113.84 14.12,113.84 v1(10.92,110.64) 11.72,109.85 11.72,106.58 ; v1(10.03,122.83) 11.72,124.51 11.72,125.63
COL0_R: length 13.6
  Bottom Layer w0.203: U1.2 40.3,85.8 40.44,85.65 51.34,85.65 51.56,85.87 R12.2
COL1: length 137.3
  Top Layer w0.203: v1(50.94,92.15) 50.94,92.31 50.98,92.35 50.36,92.35 50.04,92.67 50.04,99.34 48.72,100.66 v1(48.72,112.11) ; SW14.1 35.68,174.16 30.5,174.16 27.05,170.71 27.05,145.21 v1(26.54,144.7) 27.05,144.2 27.05,126.3 v1(26.37,125.62) 26.37,112.65 v1(26.49,112.52) 26.49,106.8 v1(26.34,106.65)
  Bottom Layer w0.203: v1(26.54,144.7) 30.74,144.7 30.77,144.68 ; 52.83,87.32 50.94,89.22 v1(50.94,92.15) ; 30.77,106.58 30.69,106.65 v1(26.34,106.65) ; v1(26.49,112.52) 48.31,112.52 v1(48.72,112.11) ; 30.77,125.63 26.37,125.63 v1(26.37,125.62)
COL1_R: length 15.9
  Bottom Layer w0.203: R13.2 52.83,85.62 52.48,85.27 40.1,85.27 39.9,85.48 U1.3
COL2: length 103.7
  Top Layer w0.203: v1(52.44,92.74) 51.11,92.74 50.67,93.18 v1(50.67,108.61) v1(50.67,123.09) v1(50.67,142.77) 50.67,174.01 50.8,174.14 57.9,174.14 SW15.1
  Bottom Layer w0.203: 54.1,87.32 52.44,88.98 v1(52.44,92.74) ; 49.82,106.58 50.67,107.43 v1(50.67,108.61) ; v1(50.67,123.09) 50.67,124.77 49.82,125.63 ; 49.82,144.68 50.67,143.82 v1(50.67,142.77)
COL2_R: length 18.1
  Bottom Layer w0.203: R14.2 54.1,85.75 53.16,84.81 39.8,84.81 39.5,85.11 U1.4
CON_USB_N: length 133.4
  Top Layer w0.155: v1(37.72,177.19) 37.9,177.19 38.68,176.4 67.41,176.4 67.74,176.07 67.74,146.2 67.18,145.64 67.18,97.6 67.03,97.44 57.16,97.44 54.23,94.51 53.21,94.51 v1(52.83,94.89)
  Bottom Layer w0.155: USB1.A7 38.1,181.14 38.1,182.14 37.86,182.38 37.18,182.38 37.07,182.27 USB1.B7 37.07,180.25 37.58,179.74 37.58,177.32 v1(37.72,177.19) ; 51.99,94.89 v1(52.83,94.89)
CON_USB_P: length 133.5
  Top Layer w0.155: v1(39.23,177.19) 38.76,177.19 38.65,177.08 38.65,176.92 38.84,176.73 67.71,176.73 68.1,176.35 68.1,146.08 67.53,145.52 67.53,97.26 67.37,97.11 57.32,97.11 54.34,94.13 53.21,94.13 v1(52.83,93.75)
  Bottom Layer w0.155: 37.57,181.11 37.66,181.02 37.66,180.46 37.81,180.31 38.32,180.31 38.47,180.46 38.47,181.02 38.66,181.21 38.66,180.46 39.12,180 D2.1 39.12,177.3 v1(39.23,177.19) ; 51.99,93.75 v1(52.83,93.75)
ENC1: length 2.1
  Bottom Layer w0.203: D15.2 SW13.2
ENC1_A: length 117.3
  Top Layer w0.203: v1(17.02,91.72) 21.97,96.67 21.97,100.73 24.77,103.53 24.77,168.81 24.62,168.95 v1(13.21,168.95)
  Bottom Layer w0.203: U1.18 34.15,89.43 33.97,89.24 33.97,89.24 31.55,86.81 21.92,86.81 v1(17.02,91.72) ; R23.2 13.27,164.41 C21.2 13.21,166.96 v1(13.21,168.95)
ENC1_B: length 94
  Top Layer w0.203: v1(25.65,168.93) 25.65,99.46 26.16,98.96 v1(26.16,98.57)
  Bottom Layer w0.203: v1(26.16,98.57) 29.35,98.57 30.31,97.61 30.31,96.21 33.49,93.03 34.65,93.03 arc(34.66,93.03) 34.68,93.03 ; v1(25.65,168.93) 25.27,169.31 19.42,169.31 18.57,168.46 18.57,166.99 C22.2 18.53,166.85 R24.2
ENC2: length 2.2
  Bottom Layer w0.203: SW14.2 40.77,172.14 D16.2
ENC2_A: length 94
  Top Layer w0.203: v1(36.37,168.98) 35.28,170.08 31.75,170.08 27.64,165.96 27.64,107.11 26.67,106.14 v1(26.67,99.31)
  Bottom Layer w0.203: v1(26.67,99.31) 27.02,98.96 29.51,98.96 30.69,97.77 30.69,96.36 33.63,93.43 U1.28 ; R28.2 36.38,164.67 C24.2 36.37,166.91 v1(36.37,168.98)
ENC2_B: length 105.6
  Top Layer w0.203: v1(27.43,99.84) 27.18,100.1 27.18,105.86 28.02,106.7 28.02,156.82 29.56,158.36 45.26,158.36 45.59,158.69 45.59,168.8 45.32,169.08 42.31,169.08 v1(41.48,168.25)
  Bottom Layer w0.203: R29.2 41.39,166.85 C25.2 41.34,168.11 v1(41.48,168.25) ; U1.29 33.35,94.25 31.07,96.52 31.07,97.93 29.67,99.34 27.94,99.34 v1(27.43,99.84)
ENC3: length 2.1
  Bottom Layer w0.203: D17.2 63.12,174.02 SW15.2
ENC3_A: length 123.1
  Top Layer w0.203: v1(34.93,95.27) 34.95,95.3 34.95,96.2 34.3,96.85 34.11,96.85 30.2,100.76 30.2,133.41 30.38,133.59 30.38,156.59 30.58,156.79 45.8,156.79 47.07,158.06 47.07,173.2 47,173.26 47,173.75 47.07,173.81 47.07,174.24 48.29,175.46 58.88,175.46 59.26,175.08 59.26,169.01 v1(59.05,168.81)
  Bottom Layer w0.203: R32.2 57.72,164.41 C27.2 57.72,167.22 59.16,168.65 59.16,168.7 v1(59.05,168.81) ; U1.30 35.9,94.93 35.56,95.27 v1(34.93,95.27)
ENC3_B: length 128.8
  Top Layer w0.203: v1(34.16,95.91) 32.2,95.91 29.69,98.41 29.69,157.17 30.02,157.5 45.5,157.5 46.1,158.11 46.1,175.16 46.99,176.04 60.2,176.04 60.96,175.28 v1(60.96,168.81)
  Bottom Layer w0.203: R33.2 62.98,166.54 C28.2 62.62,167.14 v1(60.96,168.81) ; U1.31 36.3,95.17 35.56,95.91 v1(34.16,95.91)
GPIO25: length 106.6
  Top Layer w0.203: v1(44.35,100.86) 44.35,154.1 47.63,157.38 47.63,173.47 v1(47.59,173.5)
  Bottom Layer w0.203: 26.8,177.57 27.05,177.57 29.21,175.41 45.68,175.41 v1(47.59,173.5) ; v1(44.35,100.86) 44.25,100.76 44.25,100.3 42.03,98.09 40.02,98.09 38.7,96.76 U1.37
LED0: length 5.5
  Bottom Layer w0.203: U15.4 12.38,138.01 12.53,137.87 15.25,137.87 16.16,136.97 LED4.2
LED0_BUF: length 55.5
  Top Layer w0.203: v1(32.26,100.1) 30.79,101.57 v1(30.79,133.17)
  Bottom Layer w0.203: U15.2 U15.1 14.29,133.74 14.43,133.6 30.35,133.6 v1(30.79,133.17) ; R34.1 v1(32.26,100.1)
LED0_RES: length 8.3
  Bottom Layer w0.203: R34.2 34.28,98.27 34.65,97.91 35.63,97.91 38.3,95.24 U1.36
LED1: length 16.4
  Bottom Layer w0.203: 21.75,138.42 21.75,139.4 22.55,140.2 28.65,140.2 31.98,136.88 35.31,136.88 LED5.2
LED2: length 15.8
  Bottom Layer w0.203: 40.8,138.42 42.64,140.26 48.31,140.26 50.83,137.74 53.68,137.74 LED6.2
LED3: length 93.5
  Top Layer w0.203: v1(53.92,131.86) 65.36,131.86 65.51,132 65.51,139.19 64.26,140.43 60.12,140.43 59.84,140.15 v1(59.84,139.62)
  Bottom Layer w0.203: v1(53.92,131.86) 10.37,131.86 7.57,129.05 7.57,119.22 8.11,118.69 15.58,118.69 16.35,117.92 ; 59.85,138.42 59.85,139.61 v1(59.84,139.62)
LED4: length 16.5
  Bottom Layer w0.203: LED7.4 21.75,120.4 22.71,121.36 30.58,121.36 34.02,117.92 35.4,117.92
LED5: length 16.3
  Bottom Layer w0.203: LED8.4 41.02,119.59 41.02,120.85 41.16,120.99 49.11,120.99 51.41,118.69 53.68,118.69 54.45,117.92
LED6: length 92.1
  Top Layer w0.203: v1(65.81,114.92) 65.81,120.85 65.43,121.23 60.79,121.23 v1(59.85,120.29)
  Bottom Layer w0.203: LED9.4 v1(59.85,120.29) ; LED10.2 9.87,98.87 9.73,99.01 9.73,114.81 9.93,115.01 65.72,115.01 v1(65.81,114.92)
LED7: length 15.5
  Bottom Layer w0.203: LED10.4 23.51,102.08 32.31,102.08 35.01,99.37 LED11.2
LED8: length 16.9
  Bottom Layer w0.203: LED12.2 52.26,98.87 48.26,102.87 41.6,102.87 40.8,102.06 LED11.4
QSPI_SCLK: length 26.7
  Top Layer w0.203: v1(44.15,89.79) 44.78,89.16 53.99,89.16 58.85,94.03 61.09,94.03 62.61,95.55 63.36,95.55 63.36,95.67 v1(63.42,95.73)
  Bottom Layer w0.203: v1(44.15,89.79) 43.95,89.58 43.27,89.58 43.02,89.83 U1.52 ; v1(63.42,95.73) 63.42,94.28 U4.6
QSPI_SD0: length 25.5
  Top Layer w0.203: v1(62.07,91.88) 60.69,90.49 57.45,90.49 54.51,87.55 46.2,87.55 v1(45.18,88.58)
  Bottom Layer w0.203: U4.5 62.1,91.91 v1(62.07,91.88) ; U1.53 42.68,89.43 42.9,89.2 44.55,89.2 v1(45.18,88.58)
QSPI_SD1: length 26.6
  Top Layer w0.203: v1(43.59,87.77) 43.59,87.32 45.75,85.16 64.24,85.16 v1(64.64,85.57)
  Bottom Layer w0.203: 42.9,87.77 v1(43.59,87.77) ; U1.55 42.05,88.63 42.9,87.77 ; v1(64.64,85.57) U4.2
QSPI_SD2: length 24.6
  Top Layer w0.203: v1(63.32,85.9) 47.33,85.9 47.23,85.8 46.75,85.8 46.65,85.9 46.49,85.9 46.39,85.8 43.7,88.49 43.48,88.49 v1(43.41,88.56)
  Bottom Layer w0.203: v1(63.32,85.9) 63.32,87.12 U4.3 ; v1(43.41,88.56) 43.39,88.54 42.67,88.54 42.18,89.03 U1.54
QSPI_SD3: length 28.9
  Top Layer w0.203: v1(64.52,92.48) 64.47,92.43 64.44,92.43 61.39,89.38 57.58,89.38 55.19,86.99 45.94,86.99 43.45,89.48 43.45,90.22 v1(43.4,90.27)
  Bottom Layer w0.203: 41.52,90.23 41.54,90.24 43.37,90.24 v1(43.4,90.27) ; U4.7 64.64,92.61 v1(64.52,92.48)
QSPI_SS: length 36.3
  Top Layer w0.203: v1(42.92,87.18) 42.92,86.31 44.48,84.76 65.71,84.76 v1(65.91,84.96)
  Bottom Layer w0.203: v1(42.92,87.18) 41.87,88.23 41.52,88.23 ; v1(65.91,84.96) U4.1 68.87,87.17 68.88,87.17 72.11,87.17 R7.2
RESETN: length 28.4
  Bottom Layer w0.203: U1.26 34.65,92.65 33.33,92.65 29.93,96.05 29.93,97.37 29.73,97.57 25.79,97.57 25.78,97.56 25.02,97.56 23.88,96.42 22.23,96.42 20.83,95.02 15.18,95.02 C20.2 14.12,93.97 12.96,93.97 11.51,92.51 11.51,92.22
ROW0: length 125.5
  Top Layer w0.203: v1(12.7,148.36) 12.14,148.36 10.62,146.83 10.62,113.84 11.51,112.95 11.51,110.4 4.52,103.41 4.52,88.39 v1(4.83,88.09)
  Bottom Layer w0.203: D8.1 65.66,148.87 64.39,150.14 50.04,150.14 48.29,148.39 D7.1 44.86,150.14 31.12,150.14 29.24,148.26 D6.1 27.18,148.51 27.18,149.88 26.91,150.15 12.84,150.15 12.7,150.01 v1(12.7,148.36) ; R18.2 v1(4.83,88.09)
ROW0_R: length 36.1
  Bottom Layer w0.203: U1.11 36.7,86.55 35.06,84.91 4.9,84.91 3.81,86 R18.1
ROW1: length 103.1
  Top Layer w0.203: v1(12.8,129.46) 12.45,129.1 12.45,110.13 6.86,104.54 v1(6.86,88.09)
  Bottom Layer w0.203: v1(12.8,129.46) 12.8,130.91 13,131.1 26.16,131.1 27.3,129.96 D9.1 29.49,129.34 31.12,130.96 45.09,130.96 46.38,129.66 D10.1 48.42,129.34 50.04,130.96 64.26,130.96 64.41,130.82 64.41,130.46 D11.1 ; R19.2 v1(6.86,88.09)
ROW1_R: length 33.3
  Bottom Layer w0.203: R19.1 5.84,85.87 6.43,85.29 34.9,85.29 36.3,86.69 U1.12
ROW2: length 81
  Top Layer w0.203: v1(8.71,88.09) 7.87,88.92 7.87,104.29 13.59,110 v1(13.97,110)
  Bottom Layer w0.203: v1(13.97,110) 15.37,111.4 25.94,111.4 D12.1 28.19,110.92 30.51,110.92 31.5,111.91 46,111.91 46.48,111.43 D13.1 46.96,111.02 64.28,111.02 64.76,110.54 65.41,110.54 D14.1 ; R20.2 v1(8.71,88.09)
ROW2_R: length 30.2
  Bottom Layer w0.203: R20.1 7.87,86.26 8.36,85.77 34.79,85.77 35.9,86.88 U1.13
ROW3: length 143.8
  Top Layer w0.203: v1(10.54,88.09) 10.38,88.09 9.49,88.97 9.49,104.61 15.08,110.19 15.08,110.59 13.2,112.47 13.2,128.7 13.49,128.99 13.49,130.85 12.92,131.42 12.92,147.33 13.44,147.85 15.97,147.85 16.11,147.99 16.11,151.68 21.81,157.38 21.81,163.22 21.43,163.6 16.35,163.6 16.15,163.8 16.15,163.96 ; 16.15,163.96 16.13,163.98 ; 16.15,163.96 v1(16.15,167.79)
  Bottom Layer w0.203: v1(16.15,167.79) 16.15,169.49 16.35,169.69 63.12,169.69 ; R25.2 v1(10.54,88.09)
ROW3_R: length 27.2
  Bottom Layer w0.203: 9.58,87.22 9.58,86.97 10.34,86.2 34.68,86.2 35.5,87.02 U1.14
SWCLK: length 76.5
  Top Layer w0.203: H1.3 71.5,116.91 v1(68.73,114.14) ; v1(28.65,113.15) 28.65,105.66 28.13,105.14 28.13,96.73 v1(28.57,96.29)
  Bottom Layer w0.203: v1(28.57,96.29) 28.6,96.31 33.06,91.85 34.65,91.85 U1.24 ; v1(28.65,113.15) 67.74,113.15 v1(68.73,114.14)
SWDIO: length 81.1
  Top Layer w0.203: H1.1 68.15,125.52 v1(68.15,114.78) ; v1(28.85,114.42) 29.24,114.04 29.24,105.41 28.83,105 28.83,98.73 29.35,98.22 v1(29.35,96.88)
  Bottom Layer w0.203: v1(68.15,114.78) 67.68,114.31 48.16,114.31 47.97,114.5 47.48,114.5 47.29,114.31 29.12,114.31 28.93,114.5 v1(28.85,114.42) ; v1(29.35,96.88) 29.3,96.88 29.3,96.15 33.21,92.23 34.65,92.23 arc(34.66,92.23) U1.25
USB_5V: length 151.8
  Top Layer w1.016: v1(7.87,140.76) 7.77,140.87 v1(3.89,140.87) 3.89,175 7.21,178.33 27,178.33 v1(28.98,180.31) v1(29.66,179.63) 30.15,179.14 v1(47.9,179.14) 49.15,179.14 v1(49.5,179.5) 50.39,180.39 v1(50.39,180.41)
  Bottom Layer w0.508: USB1.A4B9 35.42,180.27 34.49,179.35 32.18,179.35 31.75,179.78 D5.2 30.28,180.24 C14.1 30.21,180.31 v1(28.98,180.31) ; U15.5 14.29,139.72 C40.2 ; USB1.B4A9 40.22,179.84 40.44,179.63 41.95,179.63 42.69,180.37 D4.2 45.54,180.37 C13.1 48.48,180.42 R35.1 50.32,180.34 v1(50.39,180.41)
  Bottom Layer w0.762: U2.1 1.69,108.76
  Bottom Layer w1.016: v1(3.89,140.87) 1.45,138.43 1.45,109.08 1.58,109.08 1.69,108.96 C15.1 ; v1(7.87,140.76) 7.91,140.8 C40.2
  vias: v1(2.49,141.45) v1(4.6,141.45) v1(4.62,139.95) v1(30.4,178.97)
USBN: length 10.8
  Top Layer w0.155: v1(48.54,93.83) 48.08,93.37 44.24,93.37 43.64,92.78 v1(43.28,92.78)
  Bottom Layer w0.155: R2.1 50.73,94.49 50.36,94.49 49.48,93.61 49.32,93.61 49.1,93.83 v1(48.54,93.83) ; 41.52,92.23 42.46,92.23 42.94,92.7 43.02,92.7 43.18,92.86
USBP: length 10.7
  Top Layer w0.155: v1(48.64,93.04) 44.76,93.04 v1(44.07,92.35)
  Bottom Layer w0.155: v1(48.64,93.04) 49.1,93.04 49.32,93.26 49.62,93.26 50.5,94.15 50.73,94.15 R3.1 ; v1(44.07,92.35) 43.94,92.22 43.05,92.22 42.82,91.99 42.69,91.99 42.53,91.83 U1.47
USER_LED2_B: length 116.9
  Top Layer w0.203: v1(40.83,96.29) 41.02,96.29 41.81,97.08 42.95,97.08 46.91,101.04 46.91,152.22 49.81,155.12 49.81,174.77 v1(49.75,174.82)
  Bottom Layer w0.203: R38.1 24.89,177.76 24.89,179.98 25.8,180.89 26.97,180.89 31.69,176.17 34.26,176.17 34.28,176.16 48.42,176.16 v1(49.75,174.82) ; U1.40 39.92,94.27 39.92,95.57 40.64,96.29 v1(40.83,96.29)
USER_LED2_G: length 115.6
  Top Layer w0.203: v1(40.09,96.66) 40.98,97.56 42.69,97.56 46.1,100.97 46.1,152.93 49.23,156.05 v1(49.23,172.28)
  Bottom Layer w0.203: U1.39 39.52,94.27 39.52,96.09 v1(40.09,96.66) ; v1(49.23,172.28) 48.11,171.17 23.16,171.17 22.35,171.98 R37.1
USER_LED2_R: length 115.7
  Top Layer w0.203: v1(45.18,100.87) 45.18,153.66 48.51,156.99 48.51,170.46 v1(48.64,170.58)
  Bottom Layer w0.203: v1(48.64,170.58) 48.56,170.51 21.31,170.51 20.57,171.25 20.57,176.68 R36.1 ; v1(45.18,100.87) 45.18,100.29 42.42,97.53 40.13,97.53 39.1,96.5 U1.38
X_R: length 4
  Bottom Layer w0.203: U3.3 24.49,93.18 C18.1 25.27,92.49 R6.2
XIN: length 14.9
  Bottom Layer w0.203: U3.1 21.74,90.71 C17.1 23.41,89.13 24.11,88.42 R7NF.2 30.87,88.42 32.67,90.23 34.68,90.23
XOUT: length 9.2
  Bottom Layer w0.203: U1.21 31.93,90.63 31.24,89.94 29.47,89.94 R7NF.1 28.71,89.93 27.04,91.6 R6.1
$1N4579: length 3.5
  Bottom Layer w0.203: USB1.A5 36.57,180.52 34.93,178.87 34.93,178.45 R5.2
$1N4584: length 5
  Bottom Layer w0.203: 42.09,178.5 42.22,178.64 42.22,178.88 42.02,179.08 39.89,179.08 39.57,179.4 USB1.B5
$1N7293: length 11.8
  Bottom Layer w0.203: NFR8.1 72.08,85.42 73.96,85.42 R7.1 74.77,86.23 SW1.4 SW1.3
$1N7582: length 9.2
  Bottom Layer w0.203: 10.76,90.76 10.76,92.08 ; 10.76,92.08 R9.1 ; 10.76,92.08 10.76,92.31 SW2.4 SW2.3
$1N8008: length 3.7
  Top Layer w0.203: v1(26.8,180.24) 26.8,182.07 LED1.1
  Bottom Layer w0.203: R10.2 v1(26.8,180.24)
$1N8163: length 3.4
  Top Layer w0.203: v1(23.29,182.31) 23.24,182.36 LED2.1
  Bottom Layer w0.203: R11.2 24.47,181.96 23.64,181.96 v1(23.29,182.31)
$1N12025: length 16.5
  Top Layer w0.203: v1(20.7,181.19) 16.85,181.19 12.7,185.34 9.92,185.34 9.77,185.2 9.77,184.56
  Bottom Layer w0.203: 20.71,178.07 20.71,178.33 ; 20.71,178.33 20.71,181.19 v1(20.7,181.19) ; 20.71,178.33 R36.2
$1N12030: length 15.5
  Top Layer w0.203: LED13.3 12.7,184.56 16.65,180.61 v1(22.35,180.61)
  Bottom Layer w0.203: v1(22.35,180.61) 22.35,178.54
$1N12044: length 16.6
  Top Layer w0.203: v1(24,180.02) 15.96,180.02 12.32,183.66 10.67,183.66 LED13.4
  Bottom Layer w0.203: v1(24,180.02) 24,178.41
$2N649: length 2.8
  Bottom Layer w0.203: 25.17,147.22 26.13,147.22 D6.2
$2N758: length 2.9
  Bottom Layer w0.203: 44.22,147.22 45.44,147.22 D7.2
$2N864: length 2.9
  Bottom Layer w0.203: D8.2 64.36,147.22 63.27,147.22
$2N1178: length 2.6
  Bottom Layer w0.203: 25.17,128.17 26.34,126.99 D9.2
$2N1180: length 2.7
  Bottom Layer w0.203: D10.2 45.21,128.17 44.22,128.17
$2N1182: length 2.6
  Bottom Layer w0.203: 63.27,128.17 64.31,127.12 D11.2
$2N1496: length 2.7
  Bottom Layer w0.203: 25.17,109.12 25.88,109.12 D12.2
$2N1498: length 2.6
  Bottom Layer w0.203: D13.2 45.13,108.2 44.22,109.12
$2N1500: length 2.7
  Bottom Layer w0.203: 63.27,109.12 64.99,109.12 D14.2
$2N22693: length 5.1
  Bottom Layer w0.203: SW14.B 40.77,162.21 R27.2 R29.1
$2N22698: length 5.5
  Bottom Layer w0.203: R28.1 R26.2 37.58,161.55 SW14.A
$2N22710: length 5
  Bottom Layer w0.203: SW13.B 17.78,161.06 17.03,161.81 R22.2 R24.1
$2N22717: length 5.5
  Bottom Layer w0.203: R23.1 R21.2 14.72,162.35 12.7,160.32 SW13.A
$2N22729: length 5.3
  Bottom Layer w0.203: R33.1 R31.2 61.48,161.92 62.99,160.41 SW15.B
$2N22736: length 5.2
  Bottom Layer w0.203: SW15.A 59.17,160.91 R30.2 R32.1

## Copper pours and planes (outline as drawn; the poured copper is in the pictures)
+3V3 on Top Layer: 29.46,93.83 30.04,94.4 35.22,94.4 35.38,94.56 35.38,96.47 37.87,96.47 39.13,95.21 47.8,95.21 47.8,93.09 46.29,91.57 45.47,91.57 45.47,90.3 41.96,86.79 41.88,86.79 39.73,84.63 35.64,84.63 29.46,90.8
+3V3 on Bottom Layer: 4.93,114.55 7.32,114.55 7.32,112.52 4.93,112.52
GND on Bottom Layer: 2.29,108.3 2.29,114.12 4.78,114.12 4.78,101.81 6.12,101.81 6.12,95.68 1.91,95.68 1.91,101.76 3.48,101.76 3.48,108.3
GND on Inner1: 0.26,186.96 76.07,186.96 76.07,84.53 0.26,84.53
GND on Inner2: 0.26,186.96 76.07,186.96 76.07,84.53 0.26,84.53
USB_5V on Top Layer: 1.96,142.97 11.68,142.97 11.68,139.62 1.96,139.62
USB_5V on Top Layer: 28.21,180.81 50.84,180.81 51,180.97 51,178.46 51.03,178.43 29.06,178.43 28.21,179.23
USB_5V on Bottom Layer: 1.96,141.86 4.95,141.86 4.95,139.62 1.96,139.62
USB_5V on Bottom Layer: 28.59,180.87 28.59,179.56 29.82,178.33 33.93,178.33 33.93,179.47 32.49,180.87
USB_5V on Bottom Layer: 43.08,180.95 50.79,180.95 50.89,180.84 50.89,180.11 49.35,178.57 43,178.57 43.08,178.65

Small or netless copper shapes (teardrops, artwork), in the pictures only: 54 on Inner1, 54 on Inner2
